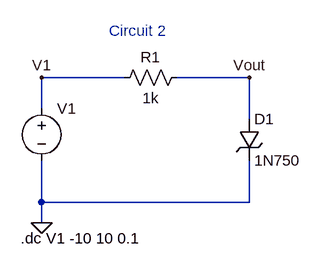
[diagram p0: schematic 2EEB_VELASCO_EXPT2_CKT2.asc]
2EEB_VELASCO_EXPT2_CKT2.asc, the LTspice schematic file:
Version 4
SHEET 1 880 680
WIRE 144 64 16 64
WIRE 336 64 224 64
WIRE 16 112 16 64
WIRE 336 128 336 64
WIRE 16 256 16 192
WIRE 336 256 336 192
WIRE 336 256 16 256
WIRE 16 288 16 256
FLAG 16 288 0
FLAG 16 64 V1
FLAG 336 64 Vout
SYMBOL voltage 16 96 R0
SYMATTR InstName V1
SYMATTR Value ""
SYMBOL zener 320 128 R0
SYMATTR InstName D1
SYMATTR Value 1N750
SYMBOL res 240 48 R90
WINDOW 0 0 56 VBottom 2
WINDOW 3 32 56 VTop 2
SYMATTR InstName R1
SYMATTR Value 1k
TEXT -16 312 Left 2 !.dc V1 -10 10 0.1
TEXT 120 -8 Left 2 ;Circuit 2

The netlist it stands for:
* 2EEB_VELASCO_EXPT2_CKT2.asc
V1 V1 0
D1 Vout 0 1N750
R1 Vout V1 1k
.model D D
.lib standard.dio
.dc V1 -10 10 0.1
* Circuit 2
.backanno
.end